# Altium schematic sheet EasyPi+ 20210521.SchDoc
size 584 x 431 mm
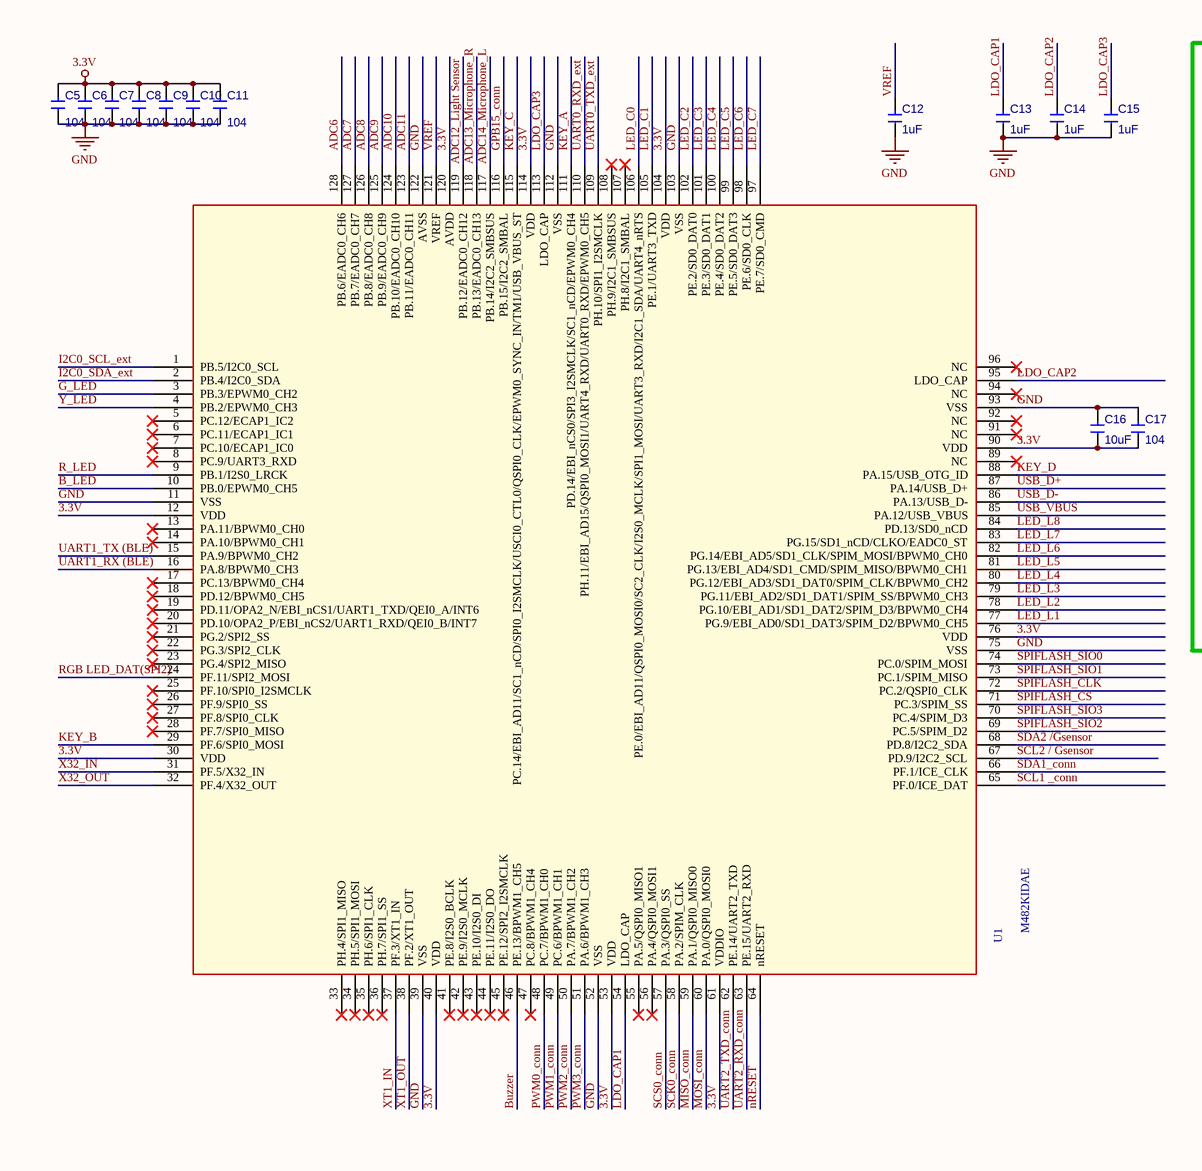
[diagram p0: EasyPi+ 20210521.SchDoc, top left]
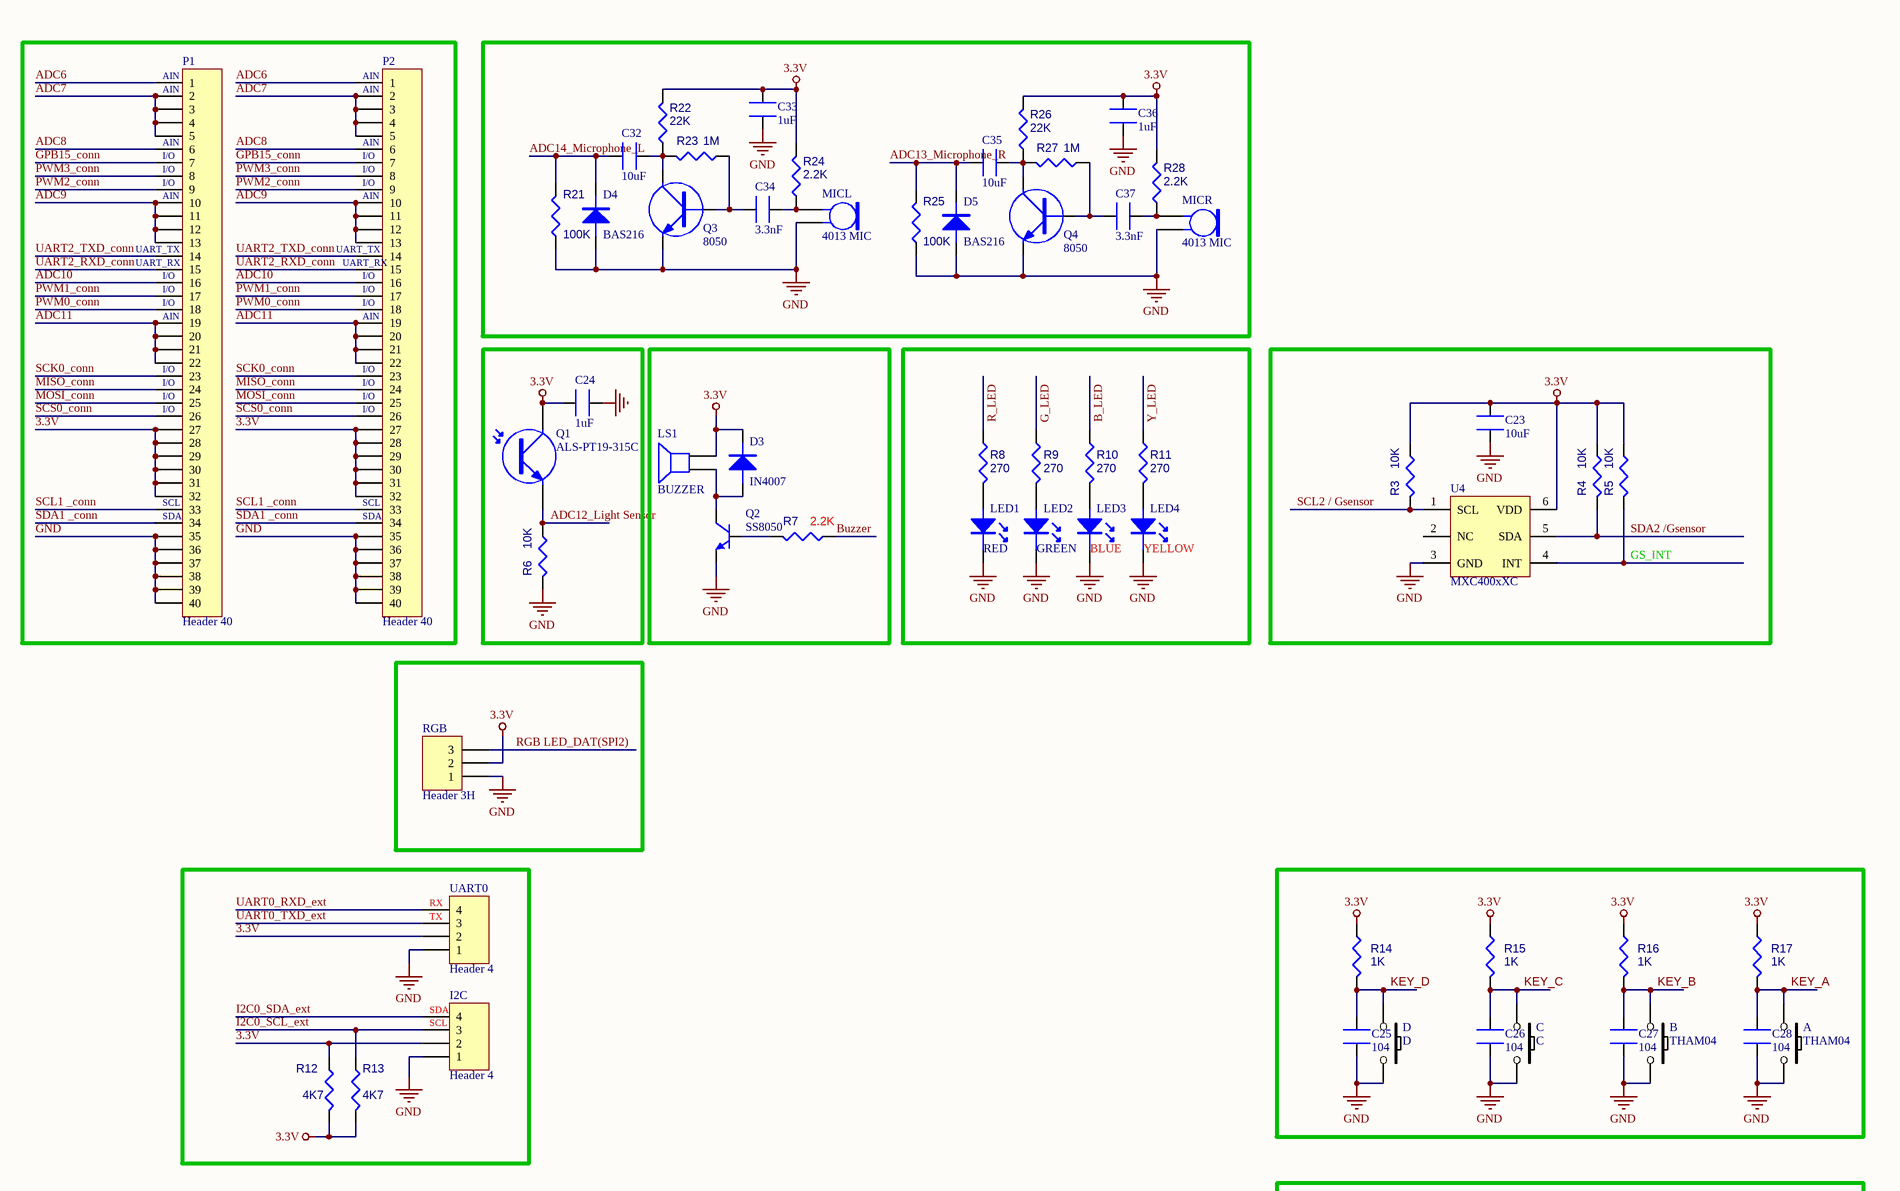
[diagram p1: EasyPi+ 20210521.SchDoc, top right]
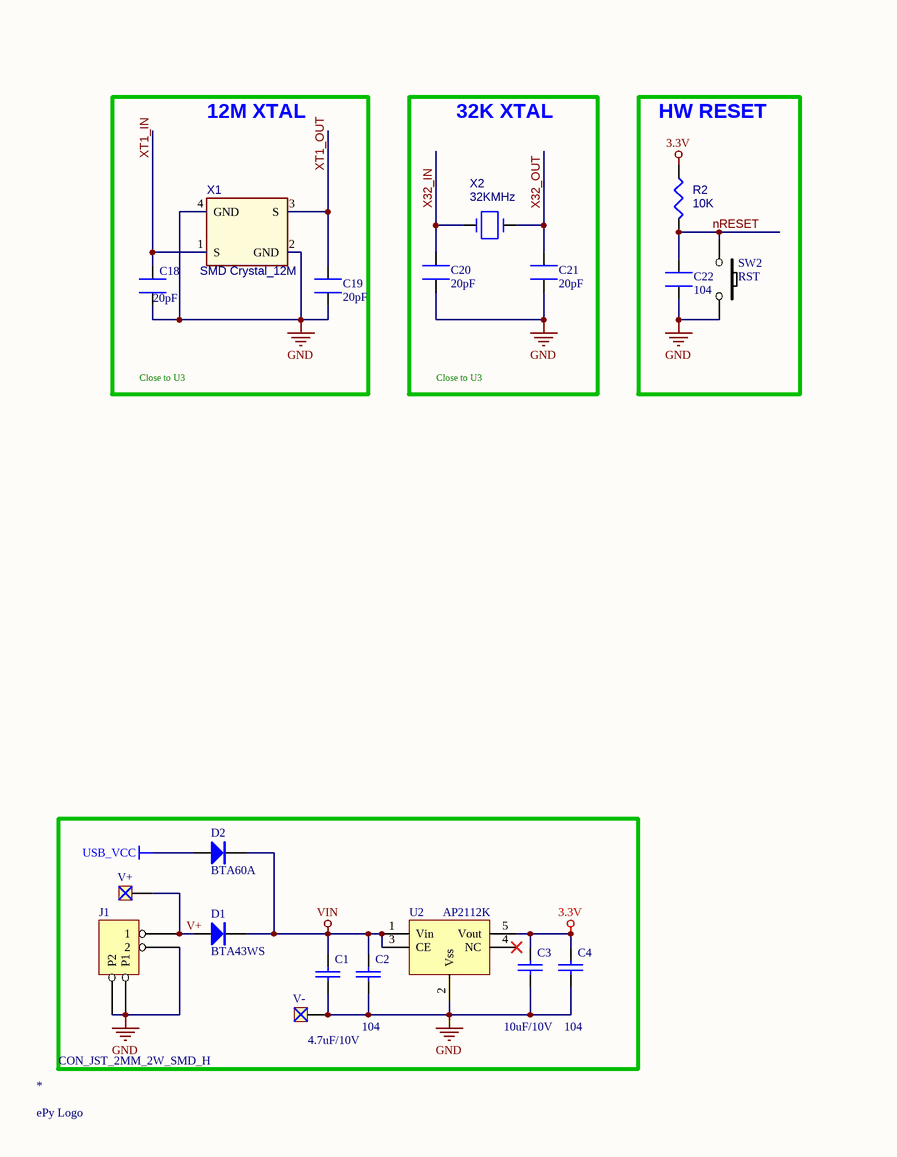
[diagram p2: EasyPi+ 20210521.SchDoc, bottom left]
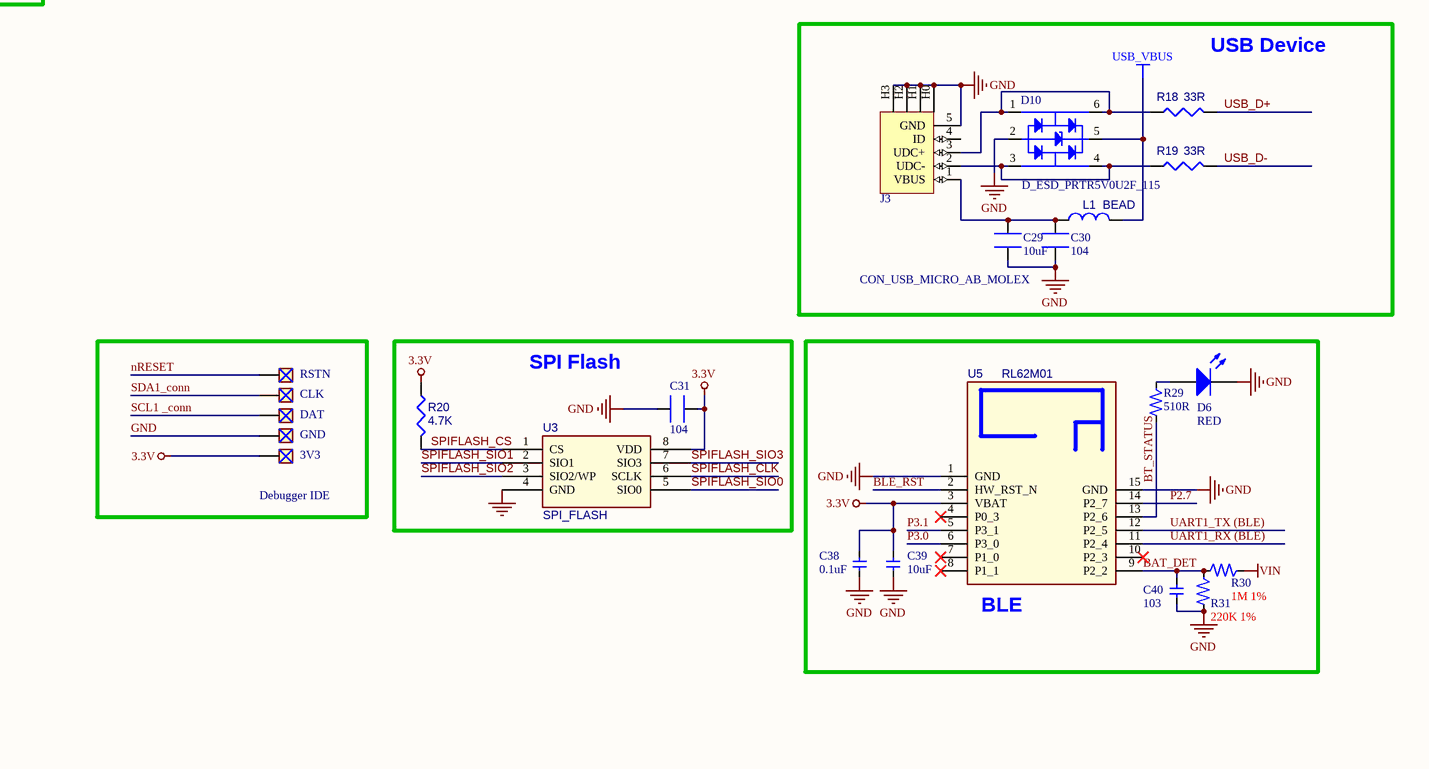
[diagram p3: EasyPi+ 20210521.SchDoc, bottom right]

## Parts
3V3  TERMINAL  [PAD-SMD]  (value not drawn)
*  ePy Logo  [ePi LOGO-M]
A  THAM04  [TC-H-4415AA]
B  THAM04  [TC-H-4415AA]
C  C  [TC-H-4415AA]
C1  4.7uF/10V  [C 0805]
C2  104  [C 0402]
C3  10uF/10V  [C 0402]
C4  104  [C 0402]
C5  104  [C 0402]
C6  104  [C 0402]
C7  104  [C 0402]
C8  104  [C 0402]
C9  104  [C 0402]
C10  104  [C 0402]
C11  104  [C 0402]
C12  1uF  [C 0402]
C13  1uF  [C 0402]
C14  1uF  [C 0402]
C15  1uF  [C 0402]
C16  10uF  [C 0402]
C17  104  [C 0402]
C18  20pF  [C 0402]
C19  20pF  [C 0402]
C20  20pF  [C 0402]
C21  20pF  [C 0402]
C22  104  [C 0402]
C23  10uF  [C 0402]
C24  1uF  [C 0402]
C25  104  [C 0402]
C26  104  [C 0402]
C27  104  [C 0402]
C28  104  [C 0402]
C29  10uF  [C 0402]
C30  104  [C 0402]
C31  104  [C 0603]
C32  10uF  [C 0402]
C33  1uF  [C 0402]
C34  3.3nF  [C 0402]
C35  10uF  [C 0402]
C36  1uF  [C 0402]
C37  3.3nF  [C 0402]
C38  0.1uF  [C 0402]
C39  10uF  [C 0402]
C40  103  [C 0402]
CLK  TERMINAL  [PAD-SMD]  (value not drawn)
D  D  [TC-H-4415AA]
D1  BTA43WS  [SOD-323]
D2  BTA60A  [SOD-323]
D3  IN4007  [SOD-123F]
D4  BAS216  [SOD123]
D5  BAS216  [SOD123]
D6  RED  [LED 0603R]
D10  D_ESD_PRTR5V0U2F_115  [SOT886]
DAT  TERMINAL  [PAD-SMD]  (value not drawn)
GND  TERMINAL  [PAD-SMD]  (value not drawn)
I2C  Header 4  [XH2.54-4P]
J1  CON_JST_2MM_2W_SMD_H  [CON_JST_S2B-PH-SM4-TB]
J3  CON_USB_MICRO_AB_MOLEX  [CON_USB_MICRO_AB_MOLEX]
L1  BEAD  [L 0603]
LED1  RED  [LED-0603]
LED2  GREEN  [LED-0603]
LED3  BLUE  [LED-0603]
LED4  YELLOW  [LED-0603]
LS1  BUZZER  [BUZER 8530]
MICL  4013 MIC  [4013 MIC]
MICR  4013 MIC  [4013 MIC]
P1  Header 40  [HEADER40]
P2  Header 40  [HEADER40]
Q1  ALS-PT19-315C  [ALS-PT19-315C]
Q2  SS8050  [SOT23-3N]
Q3  8050  [SOT23-3]
Q4  8050  [SOT23-3]
R2  10K  [R 0402]
R3  10K  [R 0402]
R4  10K  [R 0402]
R5  10K  [R 0402]
R6  10K  [R 0402]
R7  2.2K  [R 0402]
R8  270  [R 0402]
R9  270  [R 0402]
R10  270  [R 0402]
R11  270  [R 0402]
R12  4K7  [R 0402]
R13  4K7  [R 0402]
R14  1K  [R 0402]
R15  1K  [R 0402]
R16  1K  [R 0402]
R17  1K  [R 0402]
R18  33R  [R 0402]
R19  33R  [R 0402]
R20  4.7K  [R 0603]
R21  100K  [R 0402]
R22  22K  [R 0402]
R23  1M  [R 0402]
R24  2.2K  [R 0402]
R25  100K  [R 0402]
R26  22K  [R 0402]
R27  1M  [R 0402]
R28  2.2K  [R 0402]
R29  510R  [R 0402]
R30  1M 1%  [R 0603]
R31  220K 1%  [R 0603]
RGB  Header 3H  [A1254WR-S-03P]
RSTN  TERMINAL  [PAD-SMD]  (value not drawn)
SW2  RST  [T.SW/SMD/3x4 - NP]
U1  M482KIDAE  [LQFP128 14x14_N]
U2  AP2112K  [SOT23-5L]
U3  SPI_FLASH  [VSOP8 - 208mil]
U4  MXC400xXC  [MXC400xXC]
U5  RL62M01  [RL62M01A]
UART0  Header 4  [XH2.54-4P]
V+  PIN  [PAD-SMD]  (value not drawn)
V-  PIN1  [PAD-SMD]  (value not drawn)
X1  SMD Crystal_12M  [XTAL-3225]
X2  32KMHz  [XTAL-3215]

## Blocks framed on the sheet
12M XTAL: C18 C19 X1
32K XTAL: C20 C21 X2
HW RESET: C22 R2 SW2
USB Device: C29 C30 D10 J3 L1 R18 R19
Debugger IDE: 3V3 CLK DAT GND RSTN
SPI Flash: C31 R20 U3
BLE: C38-C40 D6 R29-R31 U5

## Nets
3.3V: 3V3.1 C3.1 C4.1 C5.2 C6.2 C7.2 C8.2 C9.2 C10.2 C11.2 C16.1 C17.1 C23.1 C24.1 C31.1 C33.1 C36.1 C38.1 C39.1 D3.2(K) I2C.2 LS1.1 P1.27 P1.28 P1.29 P1.30 P1.31 P1.32 P2.27 P2.28 P2.29 P2.30 P2.31 P2.32 Q1.1 R2.1 R3.1 R4.1 R5.1 R12.1 R12.2 R13.2 R14.1 R15.1 R16.1 R17.1 R20.1 R22.2 R24.2 R26.2 R28.2 RGB.2 U1.12(VDD) U1.30(VDD) U1.40(VDD) U1.53(VDD) U1.61(VDDIO) U1.76(VDD) U1.90(VDD) U1.104(VDD) U1.114(VDD) U1.120(AVDD) U2.5(Vout) U3.8(VDD) U4.6(VDD) U5.3(VBAT) UART0.2
GND: A.2 B.2 C.2 C1.2 C2.2 C3.2 C4.2 C5.1 C6.1 C7.1 C8.1 C9.1 C10.1 C11.1 C12.1 C13.1 C14.1 C15.1 C16.2 C17.2 C18.2 C19.2 C20.2 C21.2 C22.2 C23.2 C24.2 C25.2 C26.2 C27.2 C28.2 C29.2 C30.2 C31.2 C33.2 C36.2 C38.2 C39.2 C40.2 D.2 D4.1(A) D5.1(A) D6.2(K) D10.2 GND.1 I2C.1 J1.2 J1.P1 J1.P2 J3.5(GND) J3.H0 J3.H1 J3.H2 J3.H3 LED1.2(K) LED2.2(K) LED3.2(K) LED4.2(K) MICL.2 MICR.2 P1.35 P1.36 P1.37 P1.38 P1.39 P1.40 P2.35 P2.36 P2.37 P2.38 P2.39 P2.40 Q2.2(E) Q3.E Q4.E R6.2 R21.1 R25.1 R31.1 RGB.1 SW2.2 U1.11(VSS) U1.39(VSS) U1.52(VSS) U1.75(VSS) U1.93(VSS) U1.103(VSS) U1.112(VSS) U1.122(AVSS) U2.2(Vss) U3.4(GND) U4.3(GND) U5.1(GND) U5.15(GND) UART0.1 V-.1 X1.2(GND) X1.4(GND)
USB_VBUS: D10.5 L1.2 U1.85(PA.12/USB_VBUS)
USB_VCC: D2.1(A)
VIN: C1.1 C2.1 D1.2(K) D2.2(K) R30.2 U2.1(Vin) U2.3(CE)
ADC6: P1.1 P2.1 U1.128(PB.6/EADC0_CH6)
ADC7: P1.2 P1.3 P1.4 P1.5 P2.2 P2.3 P2.4 P2.5 U1.127(PB.7/EADC0_CH7)
ADC8: P1.6 P2.6 U1.126(PB.8/EADC0_CH8)
ADC9: P1.10 P1.11 P1.12 P1.13 P2.10 P2.11 P2.12 P2.13 U1.125(PB.9/EADC0_CH9)
ADC10: P1.16 P2.16 U1.124(PB.10/EADC0_CH10)
ADC11: P1.19 P1.20 P1.21 P1.22 P2.19 P2.20 P2.21 P2.22 U1.123(PB.11/EADC0_CH11)
ADC12_Light Sensor: Q1.2 R6.1 U1.119(PB.12/EADC0_CH12)
ADC13_Microphone_R: C35.1 D5.2(K) R25.2 U1.118(PB.13/EADC0_CH13)
ADC14_Microphone_L: C32.1 D4.2(K) R21.2 U1.117(PB.14/I2C2_SMBSUS)
B_LED: R10.1 U1.10(PB.0/EPWM0_CH5)
BAT_DET: C40.1 R30.1 R31.2 U5.9(P2_2)
BLE_RST: U5.2(HW_RST_N)
BT_STATUS: R29.1 U5.13(P2_6)
Buzzer: R7.1 U1.46(PE.13/BPWM1_CH5)
G_LED: R9.1 U1.3(PB.3/EPWM0_CH2)
GPB15_conn: P1.7 P2.7 U1.116(PB.15/I2C2_SMBAL)
GS_INT: R5.2 U4.4(INT)
I2C0_SCL_ext: I2C.3 R13.1 U1.1(PB.5/I2C0_SCL)
I2C0_SDA_ext: I2C.4 U1.2(PB.4/I2C0_SDA)
KEY_A: A.1 C28.1 R17.2 U1.111(PD.14/EBI_nCS0/SPI3_I2SMCLK/SC1_nCD/EPWM0_CH4)
KEY_B: B.1 C27.1 R16.2 U1.29(PF.6/SPI0_MOSI)
KEY_C: C.1 C26.1 R15.2 U1.115(PC.14/EBI_AD11/SC1_nCD/SPI0_I2SMCLK/USCI0_CTL0/QSPI0_CLK/EPWM0_SYNC_IN/TM1/USB_VBUS_ST)
KEY_D: C25.1 D.1 R14.2 U1.88(PA.15/USB_OTG_ID)
LDO_CAP1: C13.2 U1.54(LDO_CAP)
LDO_CAP2: C14.2 U1.95(LDO_CAP)
LDO_CAP3: C15.2 U1.113(LDO_CAP)
LED_C0: U1.106(PE.0/EBI_AD11/QSPI0_MOSI0/SC2_CLK/I2S0_MCLK/SPI1_MOSI/UART3_RXD/I2C1_SDA/UART4_nRTS)
LED_C1: U1.105(PE.1/UART3_TXD)
LED_C2: U1.102(PE.2/SD0_DAT0)
LED_C3: U1.101(PE.3/SD0_DAT1)
LED_C4: U1.100(PE.4/SD0_DAT2)
LED_C5: U1.99(PE.5/SD0_DAT3)
LED_C6: U1.98(PE.6/SD0_CLK)
LED_C7: U1.97(PE.7/SD0_CMD)
LED_L1: U1.77(PG.9/EBI_AD0/SD1_DAT3/SPIM_D2/BPWM0_CH5)
LED_L2: U1.78(PG.10/EBI_AD1/SD1_DAT2/SPIM_D3/BPWM0_CH4)
LED_L3: U1.79(PG.11/EBI_AD2/SD1_DAT1/SPIM_SS/BPWM0_CH3)
LED_L4: U1.80(PG.12/EBI_AD3/SD1_DAT0/SPIM_CLK/BPWM0_CH2)
LED_L5: U1.81(PG.13/EBI_AD4/SD1_CMD/SPIM_MISO/BPWM0_CH1)
LED_L6: U1.82(PG.14/EBI_AD5/SD1_CLK/SPIM_MOSI/BPWM0_CH0)
LED_L7: U1.83(PG.15/SD1_nCD/CLKO/EADC0_ST)
LED_L8: U1.84(PD.13/SD0_nCD)
MISO_conn: P1.24 P2.24 U1.59(PA.1/QSPI0_MISO0)
MOSI_conn: P1.25 P2.25 U1.60(PA.0/QSPI0_MOSI0)
nRESET: C22.1 R2.2 RSTN.1 SW2.1 U1.64(nRESET)
P2.7: U5.14(P2_7)
P3.0: U5.6(P3_0)
P3.1: U5.5(P3_1)
PWM0_conn: P1.18 P2.18 U1.48(PC.7/BPWM1_CH0)
PWM1_conn: P1.17 P2.17 U1.49(PC.6/BPWM1_CH1)
PWM2_conn: P1.9 P2.9 U1.50(PA.7/BPWM1_CH2)
PWM3_conn: P1.8 P2.8 U1.51(PA.6/BPWM1_CH3)
R_LED: R8.1 U1.9(PB.1/I2S0_LRCK)
RGB LED_DAT(SPI2): RGB.3 U1.24(PF.11/SPI2_MOSI)
SCK0_conn: P1.23 P2.23 U1.58(PA.2/SPIM_CLK)
SCL1 _conn: DAT.1 P1.33 P2.33 U1.65(PF.0/ICE_DAT)
SCL2 / Gsensor: R3.2 U1.67(PD.9/I2C2_SCL) U4.1(SCL)
SCS0_conn: P1.26 P2.26 U1.57(PA.3/QSPI0_SS)
SDA1 _conn: P1.34 P2.34
SDA1_conn: CLK.1 U1.66(PF.1/ICE_CLK)
SDA2 /Gsensor: R4.2 U1.68(PD.8/I2C2_SDA) U4.5(SDA)
SPIFLASH_CLK: U1.72(PC.2/QSPI0_CLK) U3.6(SCLK)
SPIFLASH_CS: R20.2 U1.71(PC.3/SPIM_SS) U3.1(CS)
SPIFLASH_SIO0: U1.74(PC.0/SPIM_MOSI) U3.5(SIO0)
SPIFLASH_SIO1: U1.73(PC.1/SPIM_MISO) U3.2(SIO1)
SPIFLASH_SIO2: U1.69(PC.5/SPIM_D2) U3.3(SIO2/WP)
SPIFLASH_SIO3: U1.70(PC.4/SPIM_D3) U3.7(SIO3)
UART0_RXD_ext: U1.110(PH.11/EBI_AD15/QSPI0_MOSI1/UART4_RXD/UART0_RXD/EPWM0_CH5) UART0.4
UART0_TXD_ext: U1.109(PH.10/SPI1_I2SMCLK) UART0.3
UART1_RX (BLE): U1.16(PA.8/BPWM0_CH3) U5.11(P2_4)
UART1_TX (BLE): U1.15(PA.9/BPWM0_CH2) U5.12(P2_5)
UART2_RXD_conn: P1.15 P2.15 U1.63(PE.15/UART2_RXD)
UART2_TXD_conn: P1.14 P2.14 U1.62(PE.14/UART2_TXD)
USB_D+: R18.2 U1.87(PA.14/USB_D+)
USB_D-: R19.2 U1.86(PA.13/USB_D-)
V+: D1.1(A) J1.1 V+.1
VREF: C12.2 U1.121(VREF)
X32_IN: C20.1 U1.31(PF.5/X32_IN) X2.1
X32_OUT: C21.1 U1.32(PF.4/X32_OUT) X2.2
XT1_IN: C18.1 U1.37(PF.3/XT1_IN) X1.1(S)
XT1_OUT: C19.1 U1.38(PF.2/XT1_OUT) X1.3(S)
Y_LED: R11.1 U1.4(PB.2/EPWM0_CH3)
NetC29_1: C29.1 C30.1 J3.1(VBUS) L1.1
NetC32_2: C32.2 Q3.C R22.1 R23.2
NetC34_1: C34.1 Q3.B R23.1
NetC34_2: C34.2 MICL.1 R24.1
NetC35_2: C35.2 Q4.C R26.1 R27.2
NetC37_1: C37.1 Q4.B R27.1
NetC37_2: C37.2 MICR.1 R28.1
NetD3_1: D3.1(A) LS1.2 Q2.3(C)
NetD6_1: D6.1(A) R29.2
NetD10_1: D10.1 D10.6 J3.3(UDC+) R18.1
NetD10_3: D10.3 D10.4 J3.2(UDC-) R19.1
NetLED1_1: LED1.1(A) R8.2
NetLED2_1: LED2.1(A) R9.2
NetLED3_1: LED3.1(A) R10.2
NetLED4_1: LED4.1(A) R11.2
NetQ2_1: Q2.1(B) R7.2

Not connected (* = marked no-connect by the designer): J3 4(ID); U1 5(PC.12/ECAP1_IC2)* 6(PC.11/ECAP1_IC1)* 7(PC.10/ECAP1_IC0)* 8(PC.9/UART3_RXD)* 13(PA.11/BPWM0_CH0)* 14(PA.10/BPWM0_CH1)* 17(PC.13/BPWM0_CH4)* 18(PD.12/BPWM0_CH5)* 19(PD.11/OPA2_N/EBI_nCS1/UART1_TXD/QEI0_A/INT6)* 20(PD.10/OPA2_P/EBI_nCS2/UART1_RXD/QEI0_B/INT7)* 21(PG.2/SPI2_SS)* 22(PG.3/SPI2_CLK)* 23(PG.4/SPI2_MISO)* 25(PF.10/SPI0_I2SMCLK)* 26(PF.9/SPI0_SS)* 27(PF.8/SPI0_CLK)* 28(PF.7/SPI0_MISO)* 33(PH.4/SPI1_MISO)* 34(PH.5/SPI1_MOSI)* 35(PH.6/SPI1_CLK)* 36(PH.7/SPI1_SS)* 41(PE.8/I2S0_BCLK)* 42(PE.9/I2S0_MCLK)* 43(PE.10/I2S0_DI)* 44(PE.11/I2S0_DO)* 45(PE.12/SPI2_I2SMCLK)* 47(PC.8/BPWM1_CH4)* 55(PA.5/QSPI0_MISO1)* 56(PA.4/QSPI0_MOSI1)* 89(NC)* 91(NC)* 92(NC)* 94(NC)* 96(NC)* 107(PH.8/I2C1_SMBAL)* 108(PH.9/I2C1_SMBSUS)*; U2 4(NC)*; U4 2(NC); U5 4(P0_3)* 7(P1_0)* 8(P1_1)* 10(P2_3)*

## Notes on the sheet
- (near P1) AIN
- (near P2) AIN
- (near P1) I/O
- (near P2) I/O
- (near P1) UART_TX
- (near P1) UART_RX
- (near P2) UART_TX
- (near P2) UART_RX
- (near P1) SCL
- (near P1) SDA
- (near P2) SCL
- (near P2) SDA
- (near UART0) TX
- (near UART0) RX
- (near I2C) SCL
- (near I2C) SDA
- Close to U3

## Library data of the parts
A B C D SW2 = TC SWITCH
C1-C4 C18-C37 = CAP
C5-C17 = CAP: MC (R2HF) 1uF 10V 10%(K) X5R 0402 T=0.5mm CC0402KRX5R6BB105 YAGEO; Part_Number: 150-226-0173R
C38-C40 = CAP/S
D1 D2 = FFM107: 快恢复整流二极管; BOM名称: 快恢复二极管; 版权归属: 黎明电子style; 学习资源: https://lmdzstyle.taobao.com/
D3-D5 = DIODE
D6 = LED2: Typical RED, GREEN, YELLOW, AMBER GaAs LED; Published: 8-Jun-2000; LatestRevisionDate: 17-Jul-2002; LatestRevisionNote: Re-released for DXP Platform.; PackageVersion: Feb-2002; PackageReference: 3.2X1.6X1.1; Publisher: Altium Limited; PackageDescription: SM LED; 2 Flat Leads
D10 = D_ESD_PRTR5V0U2F_115: Ultra low capacitance double rail-to-rail ESD protection; MANUFACTURER: NXP; FARNELL: 2459738; PART: PRTR5V0U2F_115
I2C UART0 = Header 4: Header, 4-Pin; LatestRevisionDate: 17-Jul-2002; LatestRevisionNote: Re-released for DXP Platform.; Publisher: Altium Limited
J1 = CON_JST_2MM_2W_SMD_H: 2 PIN 2MM SMT JST  CONNECTOR; PART: S2B-PH-SM4-TB(LF)(SN); MANUFACTURER: JST; DIGIKEY: 455-1749-1-ND; FARNELL: 9492615
J3 = CON_USB_MICRO_AB_MOLEX: USB Micro-AB socket Molex 47589-0001; RS: 702-5488; Farnell: 156-8023; PART: 47589-0001; MANUFACTURER: Molex
L1 = FB_0603
LED1-LED4 = LED
LS1 = Speaker: Loudspeaker; Published: 24-Mar-1999; LatestRevisionDate: 17-Jul-2002; LatestRevisionNote: Re-released for DXP Platform.; PackageReference: PIN2; Publisher: Altium Limited
MICL MICR = Mic2: Microphone; Published: 24-Mar-1999; LatestRevisionDate: 17-Jul-2002; LatestRevisionNote: Re-released for DXP Platform.; PackageReference: PIN2; Publisher: Altium Limited
P1 P2 = Header 40: Header, 40-Pin; LatestRevisionDate: 17-Jul-2002; LatestRevisionNote: Re-released for DXP Platform.; Publisher: Altium Limited
Q1 = Photo NPN: NPN Phototransistor; Published: 24-Mar-1999; LatestRevisionDate: 17-Jul-2002; LatestRevisionNote: Re-released for DXP Platform.; PackageReference: TO-220_A; Publisher: Altium Limited; Code_JEDEC: TO-220-AC
Q2 = 8050-SMD: 高频放大-NPN型; 版权归属: 黎明电子style; 属性: 40V 1.5A 1W 100MHZ; BOM名称: 高频放大-NPN型; 学习资源: https://lmdzstyle.taobao.com/
Q3 Q4 = NPN
R2-R28 = R
R29-R31 = RES1_30: Text Field1: HXA
RGB = Header 3H: Header, 3-Pin, Right Angle; LatestRevisionDate: 17-Jul-2002; LatestRevisionNote: Re-released for DXP Platform.; Publisher: Altium Limited
U1 = M482KIDAE: OriginalSymbolOrigin: (0,0); M482KIDAE: *; Value: *
U2 = XC6204
U3 = FLASH-Serial 8pin-91_0: IC FLASH (R) GD25Q128CSIG SOP-8 128MX1/64MX2/32MX4 2.7~3.6V SPI INDUSTRIAL GIGADEVICE
V- = PIN
X1 = XTAL_SMD
X2 = CRYSTAL/SM